# EAGLE design demux smd (EAGLE 7.5.0)
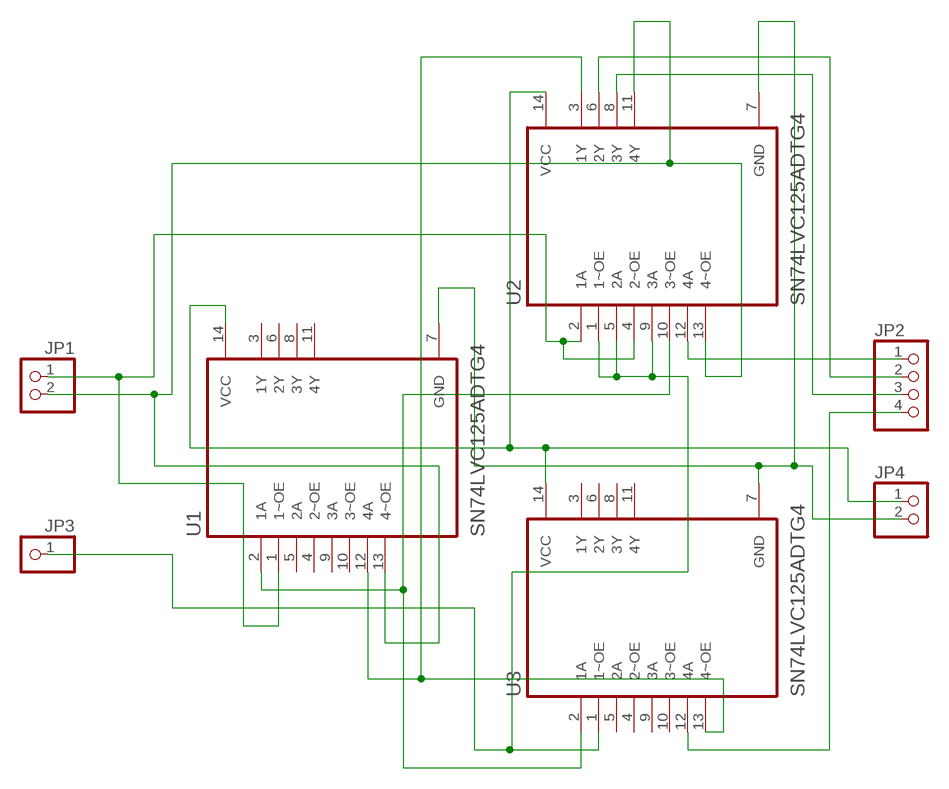
[diagram p0: schematic, sheet 1]

## Parts
JP1  PINHD-1X2  [1X02]
JP2  PINHD-1X4  [1X04]
JP3  PINHD-1X1  [1X01]
JP4  PINHD-1X2  [1X02]
U1  SN74LVC125ADTG4  [SOIC127P600X175-14N]
U2  SN74LVC125ADTG4  [SOIC127P600X175-14N]
U3  SN74LVC125ADTG4  [SOIC127P600X175-14N]

## Nets
N$1: JP3.1 U2.1(1~OE) U2.5(2A) U2.9(3A) U3.1(1~OE)
N$2: JP4.2 U1.7(GND) U2.7(GND) U3.7(GND)
N$3: JP4.1 U1.14(VCC) U2.14(VCC) U3.14(VCC)
N$4: JP2.1 U2.12(4A)
N$5: JP2.2 U2.6(2Y)
N$6: JP2.3 U2.8(3Y)
N$7: JP2.4 U3.12(4A)
N$8: U1.2(1A) U2.10(3~OE) U3.2(1A)
N$9: JP1.1 U1.1(1~OE) U2.2(1A) U2.4(2~OE)
N$10: JP1.2 U1.13(4~OE) U2.11(4Y) U2.13(4~OE)
N$11: U1.12(4A) U2.3(1Y) U3.13(4~OE)
Unconnected: U1.3(1Y) U1.4(2~OE) U1.5(2A) U1.6(2Y) U1.8(3Y) U1.9(3A) U1.10(3~OE) U1.11(4Y) U3.3(1Y) U3.4(2~OE) U3.5(2A) U3.6(2Y) U3.8(3Y) U3.9(3A) U3.10(3~OE) U3.11(4Y)

## Library data of the parts
JP1 JP4 = pinhead:PINHD-1X2: PIN HEADER
JP2 = pinhead:PINHD-1X4: PIN HEADER
JP3 = pinhead:PINHD-1X1: PIN HEADER
U1-U3 = SN74LVC125ADTG4:SN74LVC125ADTG4: Check availability <https://pricing.snapeda.com/parts/SN74LVC125ADTG4/Texas%20Instruments/view-part?ref=eda>; AVAILABILITY: In Stock; DESCRIPTION: Quadruple Bus Buffer Gate With 3-State Outputs 14-SOIC -40 to 125; MF: Texas Instruments; MP: SN74LVC125ADTG4; PACKAGE: SOIC-14 Texas Instruments; PRICE: None; PURCHASE-URL: https://pricing.snapeda.com/search/part/SN74LVC125ADTG4/?ref=eda

## Net classes
0 default: width 0.4 mm, clearance 0.25 mm

## Board
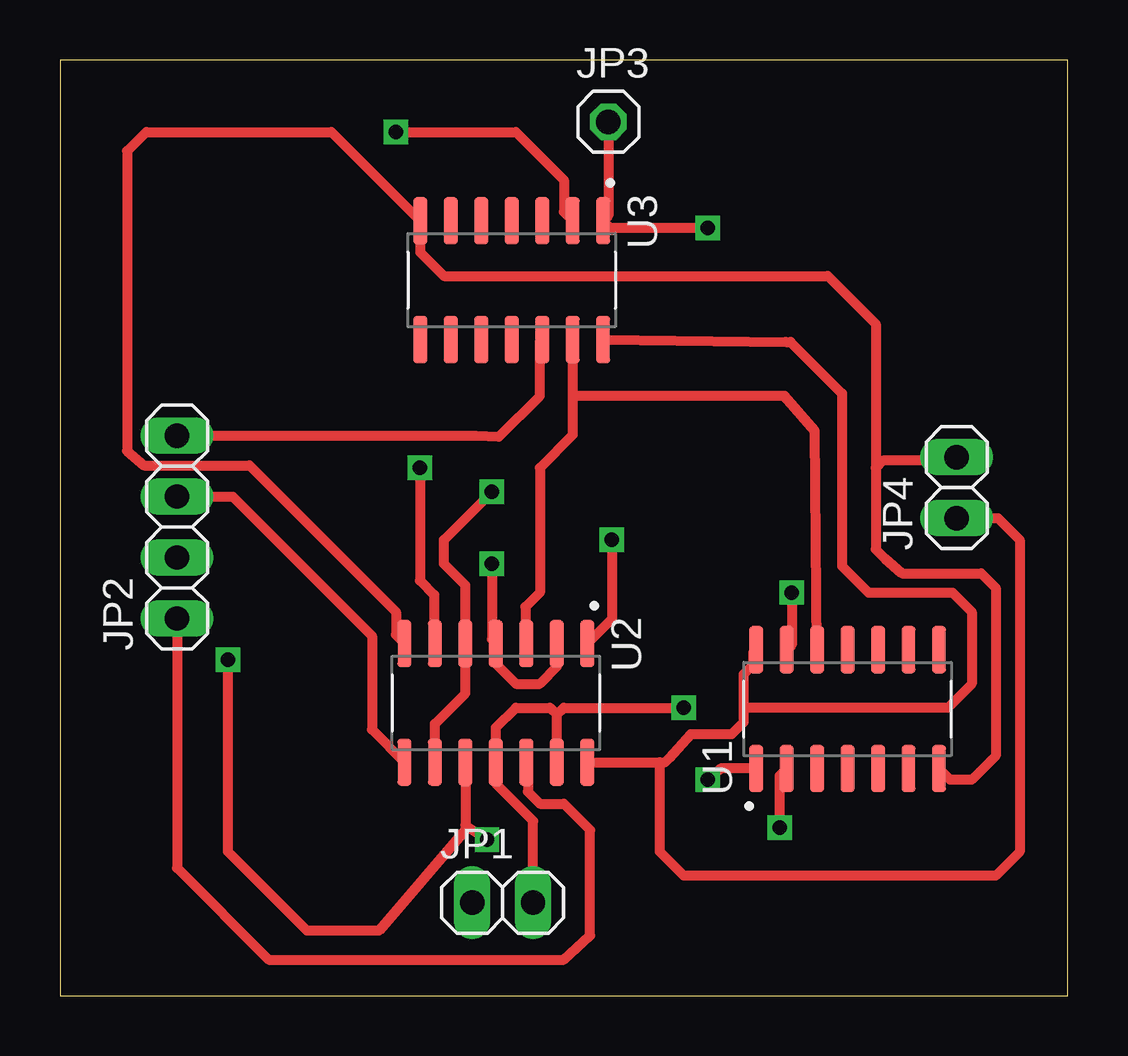
[diagram p1: board, top side]
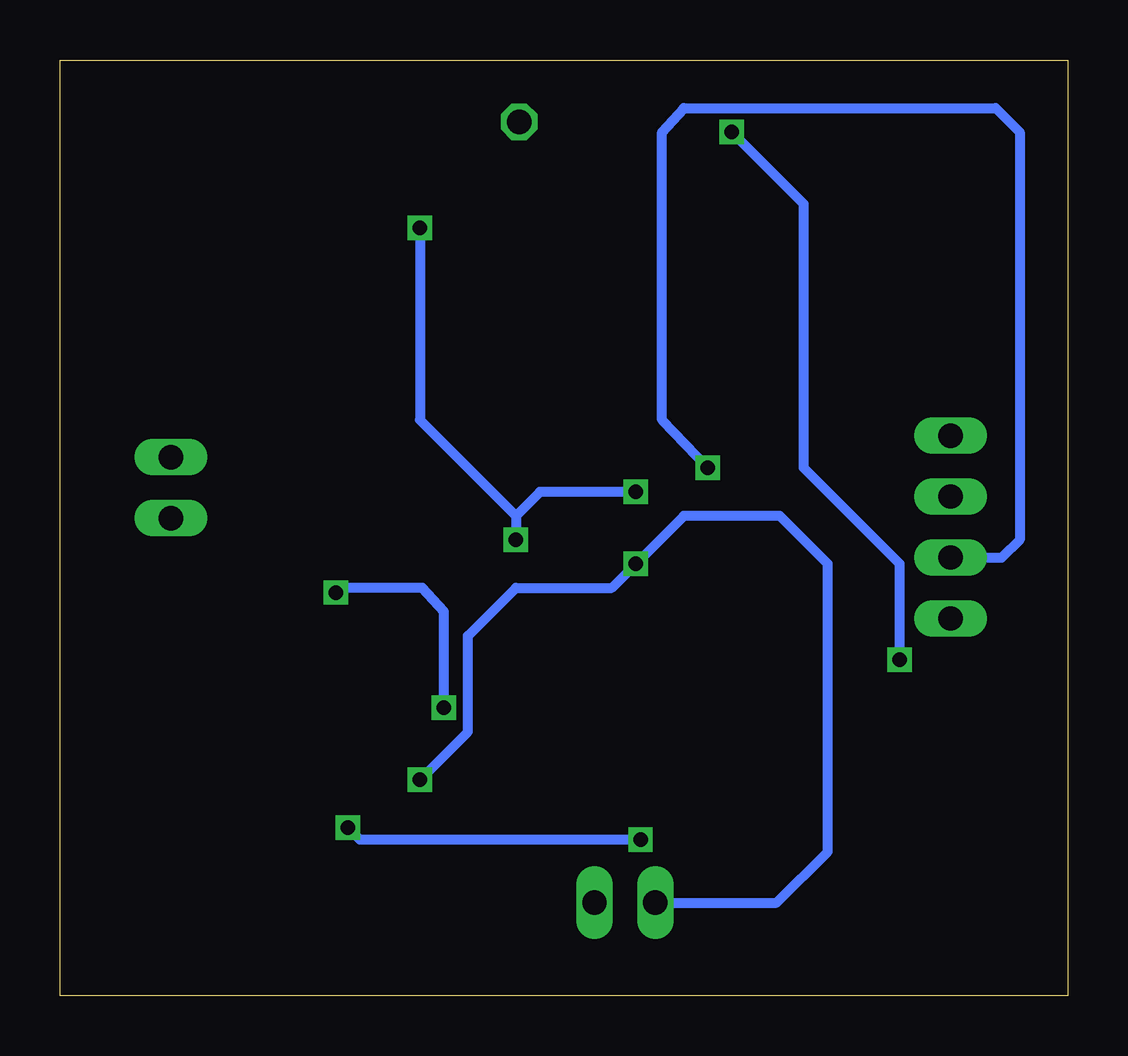
[diagram p2: board, bottom side, seen from below]

Size 42 x 39 mm. Coordinates in mm from the lower left corner, seen from the top.
Outline: 0,0 42,0 42,39 0,39 0,0
Copper layers (1*16): Top 0.035mm / dielectric 1.5mm / Bottom 0.035mm
Design rules "default": minimum track width 10mil, minimum drill 24mil, track to track 8mil, track to pad 8mil, pad to pad 8mil, via to via 8mil, smd to smd 8mil, copper to edge 40mil, drill to drill 8mil, minimum pad ring 10mil, minimum via ring 8mil, stop-mask expansion 4mil, vias tented up to drill 0mil, thermal gap 10mil

### Footprints (pad centres in the part's own frame; a part is rotated, then mirrored left to right if it is on the bottom)
1X02 = drill 1.016 long: 1 -1.27,0; 2 1.27,0
1X04 = drill 1.016 long: 1 -3.81,0; 2 -1.27,0; 3 1.27,0; 4 3.81,0
1X01 = drill 1.016 octagon: 1 0,0
SOIC127P600X175-14N = smd 1.97 x 0.6: 1 -2.475,3.81; 2 -2.475,2.54; 3 -2.475,1.27; 4 -2.475,0; 5 -2.475,-1.27; 6 -2.475,-2.54; 7 -2.475,-3.81; 8 2.475,-3.81; 9 2.475,-2.54; 10 2.475,-1.27; 11 2.475,0; 12 2.475,1.27; 13 2.475,2.54; 14 2.475,3.81

### Placement (x,y rotation side)
JP1  18.45,3.87 0 top
JP2  4.88,19.53 90 top
JP3  22.86,36.42 0 top
JP4  37.38,21.17 90 top
U1  32.83,11.94 90 top
U2  18.17,12.2 270 top
U3  18.83,29.82 270 top

### Tracks (layer width: path | path; a pad name or v marks a point on that pad's centre or on a via)
N$1  (via drill 0.6)
  Top 0.406: v18,21 16,19 16,18 16.9,17.1 U2.5 16.9,12.6 15.63,11.33 U2.9 | 22,14.7 U2.1 23,15.7 v23,19 | U3.1 22.7,32.3 | 27,32.02 v27,32 22.93,32 U3.1 | JP3.1 22.86,32.52 U3.1
  Bottom 0.406: v27,32 27,24 23,20 | v18,21 22,21 23,20 | 23,20 v23,19
N$2
  Top 0.406: JP4.2 37.24,22.3 34.3,22.3 34,22 | U1.7 37.1,9 38,9 39,10 39,17 38.4,17.6 35.1,17.6 34.4,18.2 34,18.6 34,22 | 34,22 34,28 32,30 16,30 15.02,30.98 U3.7 11.31,36 3.6,36 2.8,35.2 2.8,22.7 3.5,22.1 7.9,22.1 14,16 14,15.04 U2.7
N$3
  Top 0.406: U2.14 25,9.72 | 25,9.72 25.23,9.72 25.4,9.9 26.3,10.9 28,10.9 28.5,11.4 28.5,12 | 28.5,12 28.5,13.4 28.9,13.8 28.9,14.29 U1.14 29,14.39 | U3.14 30.25,27.25 30.45,27.25 32.6,25.1 32.6,17.9 33.7,16.8 37.2,16.8 38,16 38,13 37,12 28.5,12 | JP4.1 39.1,19.9 40,19 40,6 39,5 26,5 25,6 25,9.72
N$4
  Top 0.406: JP2.1 4.88,5.32 8.7,1.5 21,1.5 22.1,2.5 22.1,6.9 21,8 20,8 19.5,8.5 19.5,9.66 U2.12
N$5  (via drill 0.6)
  Top 0.406: v15,22 15,17.3 15.6,16.7 15.6,14.71 U2.6
  Bottom 0.406: JP2.2 2.74,18.26 2,19 2,36 3,37 16,37 16.9,36 16.9,24 v15,22
N$6
  Top 0.406: JP2.3 7.2,20.8 13,15 13,11.09 U2.8
N$7
  Top 0.406: JP2.4 17.34,23.34 18.3,23.3 20,25 20,27.25 U3.12
N$8  (via drill 0.6)
  Top 0.406: v17.8,6.5 16.9,7.1 U2.10 16.9,6.9 13.3,2.7 10.3,2.7 7,6 v7,14 | v30,7 30,9.18 U1.2 | v14,36 19,36 21,34 21,32.66 U3.2
  Bottom 0.406: v7,14 7,18 11,22 11,33 v14,36 | v17.8,6.5 29.5,6.5 v30,7
N$9  (via drill 0.6)
  Top 0.406: v18,18 18,14.85 U2.4 18.17,13.83 19,13 20,13 20.71,13.71 U2.2 | U1.1 27.54,9.46 v27,9
  Bottom 0.406: JP1.1 12.13,3.87 10,6 10,18 12,20 16,20 v18,18 19,17 23,17 25,15 25,11 v27,9
N$10  (via drill 0.6)
  Top 0.406: U2.13 20.71,11.71 | 20.71,11.71 21,12 v26,12 | v30.5,16.8 30.5,14.62 U1.13 | 20.71,11.71 20.42,12 19,12 18.17,11.17 U2.11 18.2,9.7 18.2,8.8 19.72,7.28 JP1.2
  Bottom 0.406: v26,12 26,16 26.9,17 30,17 v30.5,16.8
N$11
  Top 0.406: U3.13 21.37,25 | 21.37,25 21.37,23.37 20,22 20,16.8 19.4,16.2 19.4,14.71 U2.3 | U1.12 31.46,23.54 30.2,25 21.37,25